# Altium schematic sheet RELAY10.SchDoc
size A
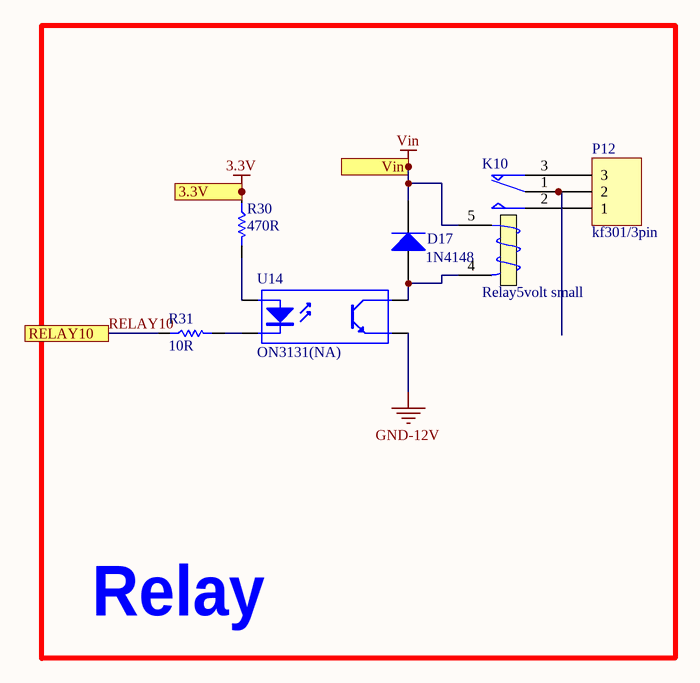
[diagram p0: RELAY10.SchDoc]

## Parts
D17  1N4148  [sod123]
K10  Relay5volt small  [relay5_childern]
P12  kf301/3pin  [Blue Connector 1*3 -kf301]
R30  470R  [0805/resistor]
R31  10R  [0805/resistor]
U14  ON3131(NA)  [OPTO_COUPLER]

## Blocks framed on the sheet
Relay: D17 K10 P12 R30 R31 U14

## Ports
3.3V, RELAY10, Vin

## Nets
3.3V: R30.1 ; port 3.3V
GND-12V: U14.3(E)
Vin: D17.K K10.5 ; port Vin
RELAY10: R31.1 ; port RELAY10
NetD17_A: D17.A K10.4(T2) U14.4(C)
NetK10_1: K10.1(COM) P12.2
NetK10_2: K10.2(NO) P12.1
NetK10_3: K10.3(T1) P12.3
NetR30_2: R30.2 U14.1(A)
NetR31_2: R31.2 U14.2(K)

## Library data of the parts
D17 = Diode 1N4007: 1 Amp General Purpose Rectifier; Published: 8-Jun-2000; LatestRevisionDate: 17-Jul-2002; LatestRevisionNote: Re-released for DXP Platform.; DatasheetVersion: 1998; PackageVersion: Aug-1999; PackageReference: DO-41; Publisher: Altium Limited; PackageDescription: Diode, Axial; Body 5.2 x 2.7 mm (LxDia. max), Lead Dia. 0.86 mm (max); Code_JEDEC: DO-204-AL; ComponentLink1Description: Manufacturer Link; ComponentLink1URL: http://www.fairchildsemi.com/; ComponentLink2Description: Datasheet; ComponentLink2URL: http://www.fairchildsemi.com/ds/1N%2F1N4001.pdf
K10 = Relay: SPDT Relay; Published: 8-Jun-2000; LatestRevisionDate: 17-Jul-2002; LatestRevisionNote: Re-released for DXP Platform.; PackageReference: MODULE5B; Publisher: Altium Limited
P12 = Header 3: LatestRevisionDate: 17-Jul-2002; LatestRevisionNote: Re-released for DXP Platform.; Publisher: Altium Limited
R30 R31 = Resistor: Tolerance: 5%; Power: 1/8 W
  R30: Value: 470R
  R31: Value: 10R
U14 = Optoisolator1: 4-Pin Phototransistor Optocoupler; Published: 24-Mar-1999; LatestRevisionDate: 04-Mar-2005; LatestRevisionNote: Sch pins 3 & 4 Swapped.; DatasheetVersion: Nov-2003; PackageReference: DIP-4; Publisher: Altium Limited